# EAGLE design BeagleBoneInterfaceBoard (EAGLE 7.2.0)
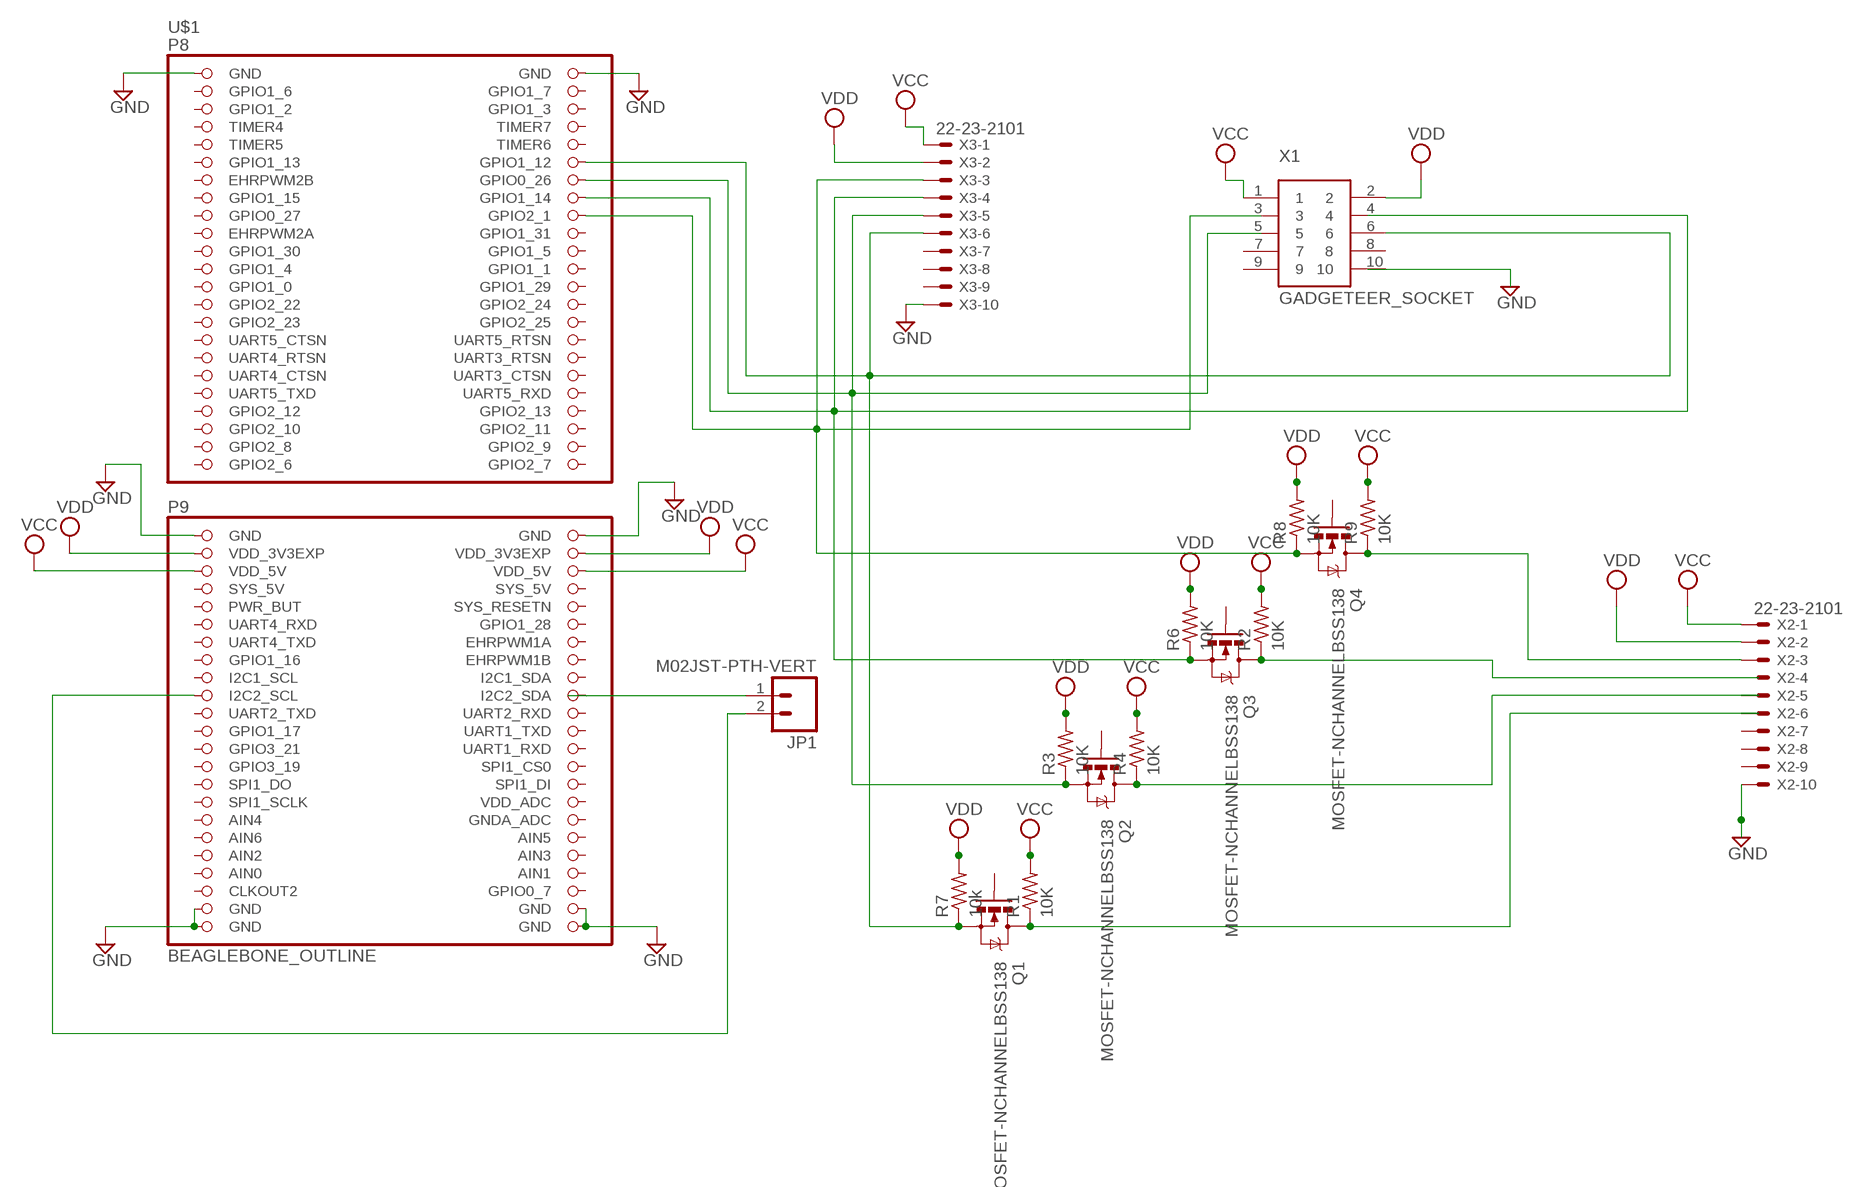
[diagram p0: schematic, sheet 1]

## Parts
JP1  M02JST-PTH-VERT  [JST-2-PTH-VERT]
Q1  MOSFET-NCHANNELBSS138  [SOT23]
Q2  MOSFET-NCHANNELBSS138  [SOT23]
Q3  MOSFET-NCHANNELBSS138  [SOT23]
Q4  MOSFET-NCHANNELBSS138  [SOT23]
R1  10K  R-US_R1210  [R1210]
R2  10K  R-US_R1210  [R1210]
R3  10K  R-US_R1210  [R1210]
R4  10K  R-US_R1210  [R1210]
R6  10K  R-US_R1210  [R1210]
R7  10k  R-US_R1210  [R1210]
R8  10K  R-US_R1210  [R1210]
R9  10K  R-US_R1210  [R1210]
U$1  BEAGLEBONE_OUTLINE  [BEAGLEBONE_SHIELD]
X1  GADGETEER_SOCKET  [SAMTEC_ESHF_2X5_1.27MM_LONG]
X2  22-23-2101  [22-23-2101]
X3  22-23-2101  [22-23-2101]

## Nets
GND: U$1.1(GND) U$1.2(GND) U$1.47(GND) U$1.48(GND) U$1.89(GND) U$1.90(GND) U$1.91(GND) U$1.92(GND) X2.10
N$1: Q3.2(S) R6.1 U$1.16(GPIO1_14) X3.4
N$2: Q4.2(S) R8.1 U$1.18(GPIO2_1) X3.3
N$3: Q1.2(S) R7.1 U$1.12(GPIO1_12) X1.6 X3.6
N$5: Q2.2(S) R3.1 U$1.14(GPIO0_26) X3.5
N$6: JP1.1
N$7: JP1.2 U$1.65(I2C2_SCL)
N$8: Q3.3(D) R2.1
N$12: Q1.3(D) R1.1
N$14: Q2.3(D) R4.1
N$16: Q4.3(D) R9.1 X2.3
VCC: R1.2 R4.2 R9.2 U$1.51(VDD_5V) U$1.52(VDD_5V) X1.1 X2.1 X3.1
VDD: R3.2 R7.2 R8.2 U$1.49(VDD_3V3EXP) U$1.50(VDD_3V3EXP) X1.2 X2.2 X3.2
Unconnected: Q1.1(G) Q2.1(G) Q3.1(G) Q4.1(G) R2.2 R6.2 U$1.3(GPIO1_6) U$1.4(GPIO1_7) U$1.5(GPIO1_2) U$1.6(GPIO1_3) U$1.7(TIMER4) U$1.8(TIMER7) U$1.9(TIMER5) U$1.10(TIMER6) U$1.11(GPIO1_13) U$1.13(EHRPWM2B) U$1.15(GPIO1_15) U$1.17(GPIO0_27) U$1.19(EHRPWM2A) U$1.20(GPIO1_31) U$1.21(GPIO1_30) U$1.22(GPIO1_5) U$1.23(GPIO1_4) U$1.24(GPIO1_1) U$1.25(GPIO1_0) U$1.26(GPIO1_29) U$1.27(GPIO2_22) U$1.28(GPIO2_24) U$1.29(GPIO2_23) U$1.30(GPIO2_25) U$1.31(UART5_CTSN) U$1.32(UART5_RTSN) U$1.33(UART4_RTSN) U$1.34(UART3_RTSN) U$1.35(UART4_CTSN) U$1.36(UART3_CTSN) U$1.37(UART5_TXD) U$1.38(UART5_RXD) U$1.39(GPIO2_12) U$1.40(GPIO2_13) U$1.41(GPIO2_10) U$1.42(GPIO2_11) U$1.43(GPIO2_8) U$1.44(GPIO2_9) U$1.45(GPIO2_6) U$1.46(GPIO2_7) U$1.54(SYS_5V) U$1.55(PWR_BUT) U$1.56(SYS_RESETN) U$1.57(UART4_RXD) U$1.58(GPIO1_28) U$1.59(UART4_TXD) U$1.60(EHRPWM1A) U$1.61(GPIO1_16) U$1.62(EHRPWM1B) U$1.63(I2C1_SCL) U$1.64(I2C1_SDA) U$1.66(I2C2_SDA) U$1.67(UART2_TXD) U$1.68(UART2_RXD) U$1.69(GPIO1_17) U$1.70(UART1_TXD) U$1.71(GPIO3_21) U$1.72(UART1_RXD) U$1.73(GPIO3_19) U$1.74(SPI1_CS0) U$1.75(SPI1_DO) U$1.76(SPI1_DI) U$1.77(SPI1_SCLK) U$1.78(VDD_ADC) U$1.79(AIN4) U$1.80(GNDA_ADC) U$1.81(AIN6) U$1.82(AIN5) U$1.83(AIN2) U$1.84(AIN3) U$1.86(AIN1) U$1.87(CLKOUT2) U$1.88(GPIO0_7) X1.3 X1.4 X1.5 X1.7 X1.8 X1.9 X1.10 X2.4 X2.5 X2.6 X2.7 X2.8 X2.9 X3.7 X3.8 X3.9 X3.10

## Power pins joined to a net without a drawn wire
AIN0: U$1.85(AIN0)
SYS_5V: U$1.53(SYS_5V)

## Library data of the parts
JP1 = SparkFun-Connectors:M02: Standard 2-pin 0.1" header. Use with - straight break away headers ( PRT-00116) - right angle break away headers (PRT-00553) - swiss pins (PRT-00743) - machine pins (PRT-00117) - female headers (PRT-00115) Molex polarized connector foot print use with: PRT-08233 with associated crimp pins and housings. 2.54_SCREWTERM for use with PRT-10571. 3.5mm Screw Terminal footprints for PRT-08084 5mm Screw Terminal footprints for use with PRT-08433
Q1-Q4 = SparkFun-DiscreteSemi:MOSFET-NCHANNEL: Common NMOSFET Parts MFG P/N Store ID Prod ID FDD8780 TRANS-09984 SI7820DN TRANS-11055 FDS6630A IC-08089 2N7002PW TRANS-11151 FQP30N06L COM-10213 TRANS-10060 BSS123LT1G TRANS-08345 BSS138 TRANS-00830 BS170 2N7000; PROD_ID: TRANS-00830
R1-R4 R6-R9 = resistor:R-US_: RESISTOR, American symbol
U$1 = adafruit:BEAGLEBONE_OUTLINE: Should match A3 pinout - but not completely tested
X1 = mark_gadgeteer_socket:GADGETEER_SOCKET
X2 X3 = con-molex:22-23-2101: .100" (2.54mm) Center Header - 10 Pin; MF: MOLEX; MPN: 22-23-2101; OC_FARNELL: 1756828; OC_NEWARK: 94C0765

## Board
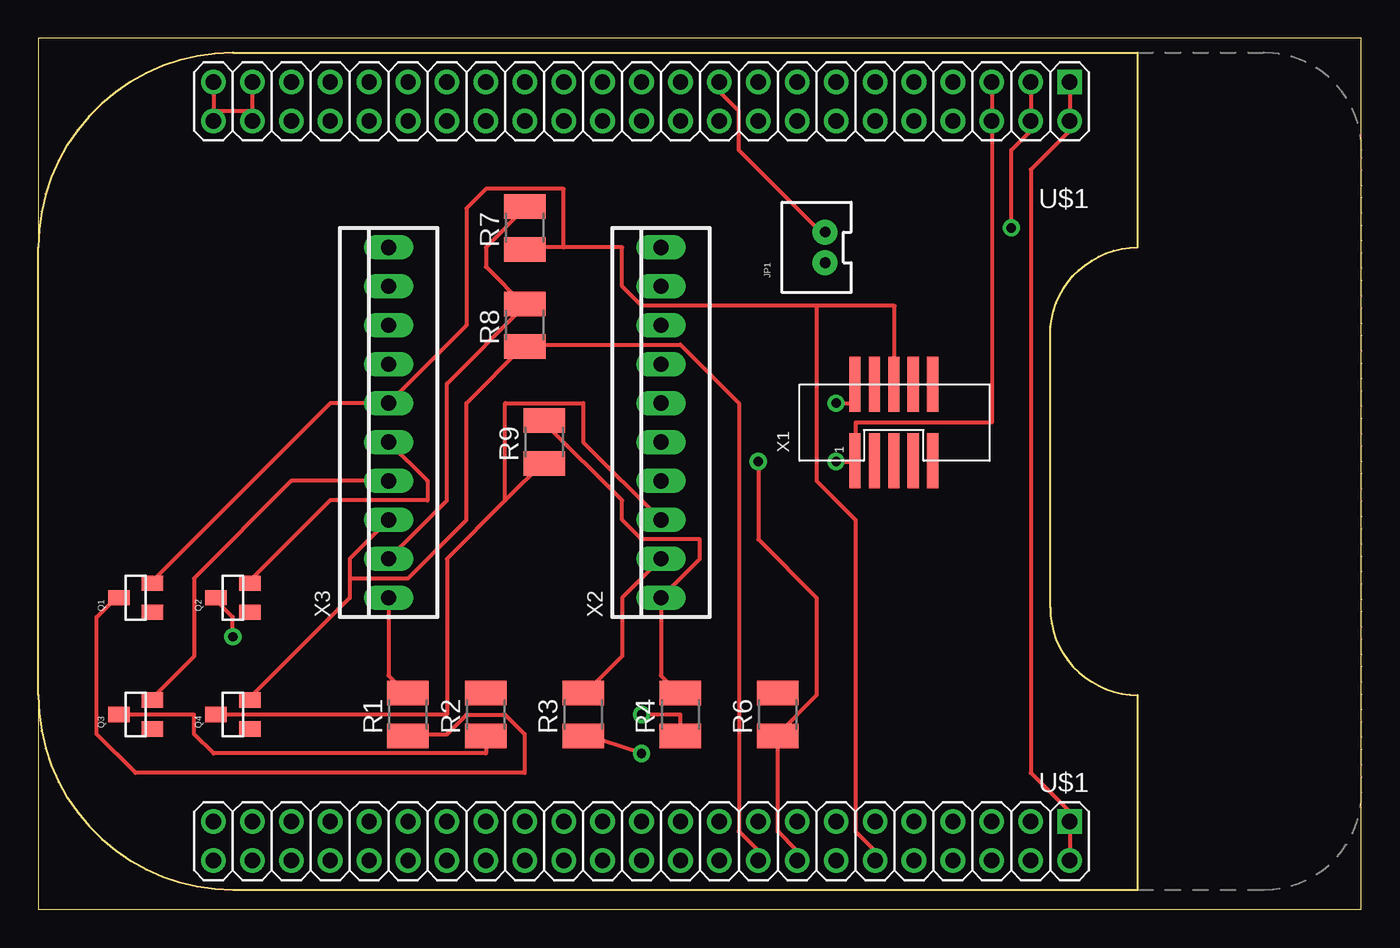
[diagram p1: board, top side]
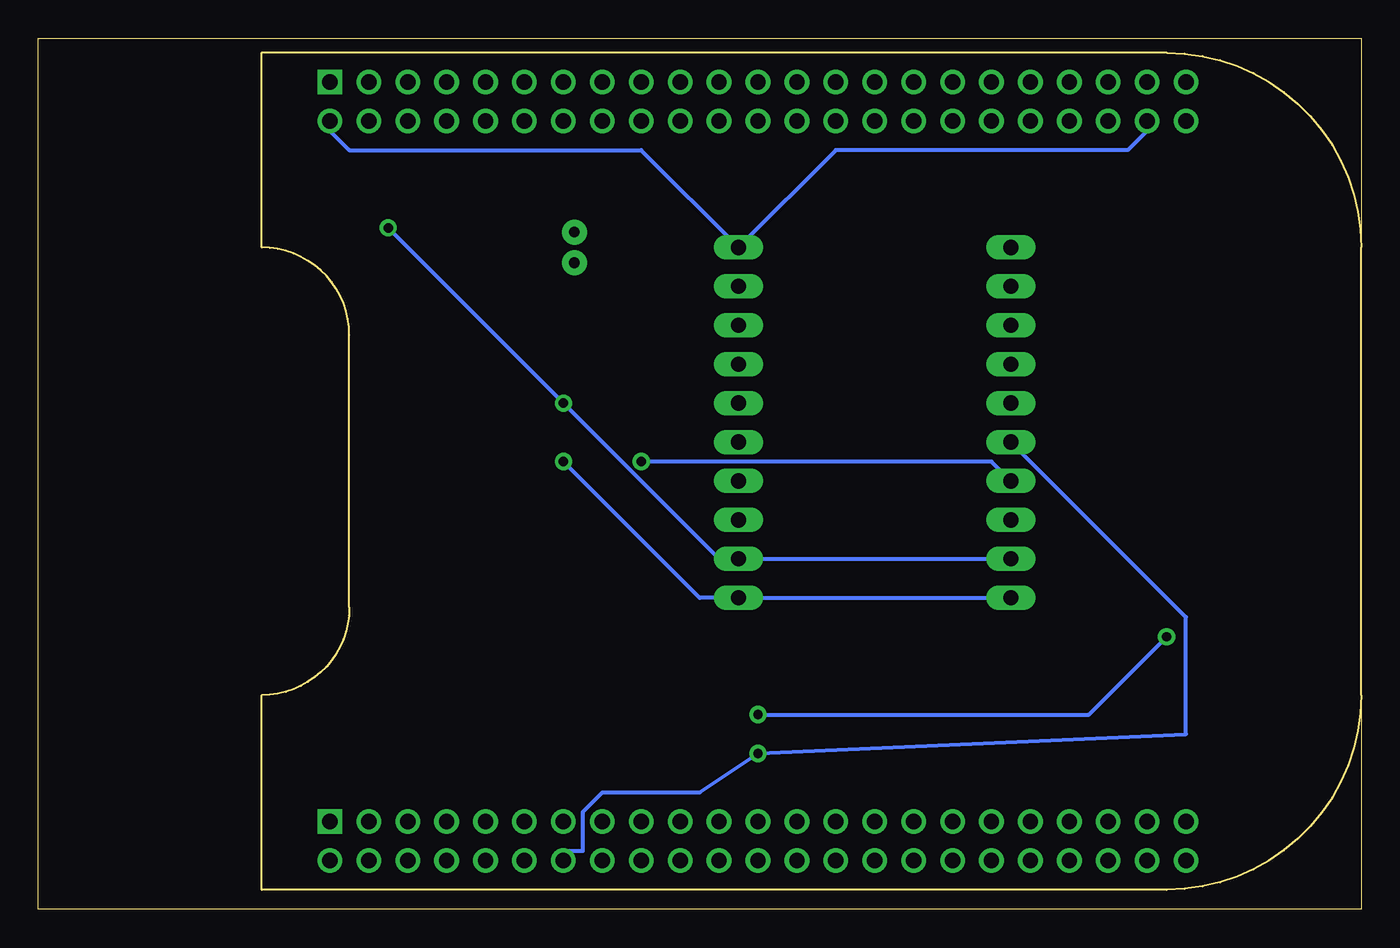
[diagram p2: board, bottom side, seen from below]

Size 86.34 x 56.82 mm. Coordinates in mm from the lower left corner, seen from the top.
Outline: 0,0 86.34,0 86.34,56.82 0,56.82 0,0
Copper layers (1*16): Top 0.035mm / dielectric 1.5mm / Bottom 0.035mm
Design rules "SparkFun": minimum track width 8mil, minimum drill 20mil, track to track 8mil, track to pad 8mil, pad to pad 8mil, via to via 8mil, smd to smd 8mil, copper to edge 10mil, drill to drill 8mil, minimum pad ring 12mil, minimum via ring 10mil, stop-mask expansion 4mil, vias tented up to drill 25mil, thermal gap 10mil

### Footprints (pad centres in the part's own frame; a part is rotated, then mirrored left to right if it is on the bottom)
JST-2-PTH-VERT = drill 0.7 pad 1.626: 1 -1,-0.55; 2 1,-0.55
SOT23 = smd 1 x 1.4: 1 -0.95,-1.1; 2 0.95,-1.1; 3 0,1.1
R1210 = smd 1.6 x 2.7: 1 -1.4,0; 2 1.4,0
BEAGLEBONE_SHIELD = drill 1 square: 1 4.445,19.05; 47 52.705,19.05 | drill 1: 2 1.905,19.05; 3 4.445,21.59; 4 1.905,21.59; 5 4.445,24.13; 6 1.905,24.13; 7 4.445,26.67; 8 1.905,26.67; 9 4.445,29.21; 10 1.905,29.21; 11 4.445,31.75; 12 1.905,31.75; 13 4.445,34.29; 14 1.905,34.29; 15 4.445,36.83; 16 1.905,36.83; 17 4.445,39.37; 18 1.905,39.37; 19 4.445,41.91; 20 1.905,41.91; 21 4.445,44.45; 22 1.905,44.45; 23 4.445,46.99; 24 1.905,46.99; 25 4.445,49.53; 26 1.905,49.53; 27 4.445,52.07; 28 1.905,52.07; 29 4.445,54.61; 30 1.905,54.61; 31 4.445,57.15; 32 1.905,57.15; 33 4.445,59.69; 34 1.905,59.69; 35 4.445,62.23; 36 1.905,62.23; 37 4.445,64.77; 38 1.905,64.77; 39 4.445,67.31; 40 1.905,67.31; 41 4.445,69.85; 42 1.905,69.85; 43 4.445,72.39; 44 1.905,72.39; 45 4.445,74.93; 46 1.905,74.93; 48 50.165,19.05; 49 52.705,21.59; 50 50.165,21.59; 51 52.705,24.13; 52 50.165,24.13; 53 52.705,26.67; 54 50.165,26.67; 55 52.705,29.21; 56 50.165,29.21; 57 52.705,31.75; 58 50.165,31.75; 59 52.705,34.29; 60 50.165,34.29; 61 52.705,36.83; 62 50.165,36.83; 63 52.705,39.37; 64 50.165,39.37; 65 52.705,41.91; 66 50.165,41.91; 67 52.705,44.45; 68 50.165,44.45; 69 52.705,46.99; 70 50.165,46.99; 71 52.705,49.53; 72 50.165,49.53; 73 52.705,52.07; 74 50.165,52.07; 75 52.705,54.61; 76 50.165,54.61; 77 52.705,57.15; 78 50.165,57.15; 79 52.705,59.69; 80 50.165,59.69; 81 52.705,62.23; 82 50.165,62.23; 83 52.705,64.77; 84 50.165,64.77; 85 52.705,67.31; 86 50.165,67.31; 87 52.705,69.85; 88 50.165,69.85; 89 52.705,72.39; 90 50.165,72.39; 91 52.705,74.93; 92 50.165,74.93
SAMTEC_ESHF_2X5_1.27MM_LONG = smd 3.6 x 0.74: 1 -2.5,2.58; 2 2.5,2.58; 3 -2.5,1.31; 4 2.5,1.31; 5 -2.5,0.04; 6 2.5,0.04; 7 -2.5,-1.23; 8 2.5,-1.23; 9 -2.5,-2.5; 10 2.5,-2.5
22-23-2101 = drill 1 long: 1 -11.43,0; 2 -8.89,0; 3 -6.35,0; 4 -3.81,0; 5 -1.27,0; 6 1.27,0; 7 3.81,0; 8 6.35,0; 9 8.89,0; 10 11.43,0

### Placement (x,y rotation side)
JP1  50.8,43.18 90 top
Q1  6.35,20.32 90 top
Q2  12.7,20.32 90 top
Q3  6.35,12.7 90 top
Q4  12.7,12.7 90 top
R1  24.13,12.7 90 top
R2  29.21,12.7 90 top
R3  35.56,12.7 90 top
R4  41.91,12.7 90 top
R6  48.26,12.7 90 top
R7  31.75,44.45 90 top
R8  31.75,38.1 90 top
R9  33.02,30.48 90 top
U$1  86.36,1.27 90 top
X1  55.88,31.75 90 top
X2  40.64,31.75 90 top
X3  22.86,31.75 90 top

### Tracks (layer width: path | path; a pad name or v marks a point on that pad's centre or on a via)
GND
  Top 0.254: U$1.91 11.43,52.07 | U$1.89 13.97,52.07 | 13.97,52.07 11.43,52.07 | 11.43,52.07 U$1.92 | 13.97,52.07 U$1.90 | U$1.2 U$1.1 67.31,6.35 64.77,8.89 64.77,48.26 67.31,50.8 U$1.48 U$1.47
  Bottom 0.254: U$1.90 13.97,50.8 15.24,49.53 34.29,49.53 X2.10 46.99,49.53 66.04,49.53 67.31,50.8 U$1.48
N$1  (via drill 0.61)
  Top 0.254: U$1.16 49.53,3.81 48.26,5.08 R6.1 48.26,11.43 50.8,13.97 50.8,20.32 46.99,24.13 v46.99,29.21 | X3.4 16.51,27.94 10.16,21.59 10.16,16.51 7.62,13.97 Q3.2
  Bottom 0.254: v46.99,29.21 24.13,29.21 X3.4
N$2
  Top 0.254: 20.32,21.59 20.32,22.86 X3.3 | 20.32,21.59 20.32,20.32 13.97,13.97 Q4.2 | 31.75,36.83 27.94,33.02 27.94,25.4 24.13,21.59 20.32,21.59 | 31.75,36.83 41.91,36.83 45.72,33.02 45.72,5.08 46.99,3.81 U$1.18 | 31.75,36.83 R8.1
N$3
  Top 0.254: Q1.2 7.62,21.59 19.05,33.02 X3.6 27.94,38.1 27.94,45.72 29.21,46.99 34.29,46.99 34.29,43.18 | 34.29,43.18 38.1,43.18 38.1,40.64 39.37,39.37 50.8,39.37 | 34.29,43.18 31.75,43.18 R7.1 | 50.8,39.37 55.88,39.37 55.88,34.29 X1.6 | 50.8,39.37 50.8,27.94 53.34,25.4 53.34,5.08 54.61,3.81 U$1.12
N$5  (via drill 0.61)
  Top 0.254: X3.5 25.4,27.94 25.4,26.67 19.05,26.67 13.97,21.59 Q2.2 | v39.37,10.16 35.56,11.43 R3.1
  Bottom 0.254: U$1.14 52.07,3.81 50.8,3.81 50.8,6.35 49.53,7.62 43.18,7.62 v39.37,10.16 11.43,11.43 11.43,19.05 X3.5
N$7
  Top 0.254: U$1.65 44.45,53.34 45.72,52.07 45.72,49.53 50.8,44.45 JP1.2
N$8
  Top 0.254: 5.08,12.7 Q3.3 10.16,12.7 10.16,11.43 11.43,10.16 29.21,10.16 R2.1 29.21,11.43
N$12
  Top 0.254: Q1.3 5.08,20.32 3.81,19.05 3.81,11.43 6.35,8.89 31.75,8.89 31.75,11.43 30.48,12.7 27.94,12.7 26.67,11.43 24.13,11.43 R1.1
N$14  (via drill 0.61)
  Top 0.254: v12.7,17.78 12.7,19.05 11.43,20.32 Q2.3 | v39.37,12.7 41.91,12.7 R4.1
  Bottom 0.254: v12.7,17.78 17.78,12.7 v39.37,12.7
N$16
  Top 0.254: 30.48,26.67 33.02,29.21 R9.1 | 30.48,26.67 26.67,22.86 26.67,12.7 Q4.3 11.43,12.7 | X2.3 35.56,30.48 35.56,33.02 30.48,33.02 30.48,26.67
VCC  (via drill 0.61)
  Top 0.254: U$1.51 U$1.52 62.23,31.75 53.34,31.75 53.34,30.48 X1.1 53.34,29.21 v52.07,29.21 | X3.1 22.86,15.24 24.13,13.97 R1.2 | R4.2 41.91,13.97 40.64,15.24 X2.1 43.18,22.86 43.18,24.13 39.37,24.13 38.1,25.4 38.1,26.67 33.02,31.75 R9.2
  Bottom 0.254: X3.1 X2.1 43.18,20.32 v52.07,29.21
VDD  (via drill 0.61)
  Top 0.254: 31.75,39.37 29.21,41.91 29.21,43.18 31.75,45.72 R7.2 | U$1.49 U$1.50 64.77,50.8 63.5,49.53 v63.5,44.45 | X2.2 38.1,20.32 38.1,16.51 35.56,13.97 R3.2 | v52.07,33.02 53.34,33.02 X1.2 | 31.75,39.37 26.67,34.29 26.67,26.67 X3.2 | 31.75,39.37 R8.2
  Bottom 0.254: X3.2 X2.2 41.91,22.86 v52.07,33.02 v63.5,44.45